# EAGLE design rev1 (EAGLE 9.6.2)
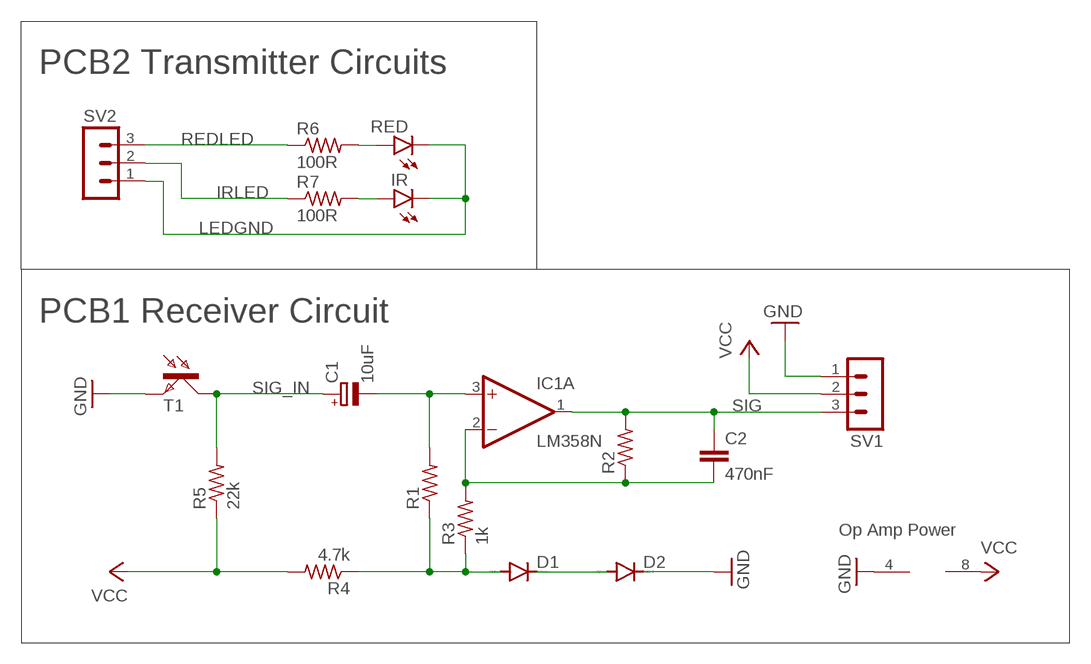
[diagram p0: schematic, sheet 1]

## Parts
C1  10uF  CPOL-EUR/2012-12R  [R/2012-12R]
C2  470nF  C2,5-3  [C2.5-3]
D1  1N4148DO35-7  [DO35-7]
D2  1N4148DO35-7  [DO35-7]
IC1  LM358N  [DIL08]
IR  LEDIRL80A  [IRL80A]
R1  R-US_0207/7  [0207/7]
R2  R-US_0207/7  [0207/7]
R3  1k  R-US_R0805  [R0805]
R4  4.7k  R-US_0207/7  [0207/7]
R5  22k  R-US_0207/7  [0207/7]
R6  100R  R-US_R0805  [R0805]
R7  100R  R-US_R0805  [R0805]
RED  LEDCHIPLED_0805  [CHIPLED_0805]
SV1  MA03-1  [MA03-1]
SV2  MA03-1  [MA03-1]
T1  LPT80A  [LPT80A]

## Nets
GND: D2.C IC1.4(P:V-) SV1.1 T1.E
IRLED: R7.1 SV2.2
LEDGND: IR.K(C) RED.C SV2.1
N$1: C1.- IC1.3(A:+IN) R1.2
N$2: R6.2 RED.A
N$3: C2.2 IC1.2(A:-IN) R2.1 R3.2
N$5: D1.C D2.A
N$7: IR.A R7.2
N$8: D1.A R1.1 R3.1 R4.1
REDLED: R6.1 SV2.3
SIG: C2.1 IC1.1(A:OUT) R2.2 SV1.3
SIG_IN: C1.+ R5.2 T1.C
VCC: IC1.8(P:V+) R4.2 R5.1 SV1.2
Unconnected: IC1.5(B:+IN) IC1.6(B:-IN) IC1.7(B:OUT)

## Notes on the sheet
- PCB2 Transmitter Circuits
- PCB1 Receiver Circuit
- Op Amp Power

## Library data of the parts
C1 = rcl:CPOL-EU: POLARIZED CAPACITOR, European symbol; SPICEPREFIX: C
C2 = capacitor-wima:C: CAPACITOR naming: grid - package width
D1 D2 = diode:1N4148: DIODE high speed (Philips)
IC1 = linear:LM358: OP AMP also LM158; LM258; LM2904 Source: http://cache.national.com/ds/LM/LM158.pdf
IR RED = led:LED: LED OSRAM: - CHIPLED LG R971, LG N971, LY N971, LG Q971, LY Q971, LO R971, LY R971 LH N974, LH R974 LS Q976, LO Q976, LY Q976 LO Q996 - Hyper CHIPLED LW Q18S LB Q993, LB Q99A, LB R99A - SideLED LS A670, LO A670, LY A670, LG A670, LP A670 LB A673, LV A673, LT A673, LW A673 LH A674 LY A675 LS A676, LA A676, LO A676, LY A676, LW A676 LS A679, LY A679, LG A679 - Hyper Micro SIDELED® LS Y876, LA Y876, LO Y876, LY Y876 LT Y87S - SmartLED LW L88C, LW L88S LB L89C, LB L89S, LG L890 LS L89K, LO L89K, LY L89K LS L896, LA L896, LO L896, LY L896 - TOPLED LS T670, LO T670, LY T670, LG T670, LP T670 LSG T670, LSP T670, LSY T670, LOP T670, LYG T670 LG T671, LOG T671, LSG T671 LB T673, LV T673, LT T673, LW T673 LH T674 LS T676, LA T676, LO T676, LY T676, LB T676, LH T676, LSB T676, LW T676 LB T67C, LV T67C, LT T67C, LS T67K, LO T67K, LY T67K, LW E67C LS E67B, LA E67B, LO E67B, LY E67B, LB E67C, LV E67C, LT E67C LW T67C LS T679, LY T679, LG T679 LS T770, LO T770, LY T770, LG T770, LP T770 LB T773, LV T773, LT T773, LW T773 LH T774 LS E675, LA E675, LY E675, LS T675 LS T776, LA T776, LO T776, LY T776, LB T776 LHGB T686 LT T68C, LB T68C - Hyper Mini TOPLED® LB M676 - Mini TOPLED Santana® LG M470 LS M47K, LO M47K, LY M47K Source: http://www.osram.convergy.de LUXEON: - LUMILED® LXK2-PW12-R00, LXK2-PW12-S00, LXK2-PW14-U00, LXK2-PW14-V00 LXK2-PM12-R00, LXK2-PM12-S00, LXK2-PM14-U00 LXK2-PE12-Q00, LXK2-PE12-R00, LXK2-PE12-S00, LXK2-PE14-T00, LXK2-PE14-U00 LXK2-PB12-K00, LXK2-PB12-L00, LXK2-PB12-M00, LXK2-PB14-N00, LXK2-PB14-P00, LXK2-PB14-Q00 LXK2-PR12-L00, LXK2-PR12-M00, LXK2-PR14-Q00, LXK2-PR14-R00 LXK2-PD12-Q00, LXK2-PD12-R00, LXK2-PD12-S00 LXK2-PH12-R00, LXK2-PH12-S00 LXK2-PL12-P00, LXK2-PL12-Q00, LXK2-PL12-R00 Source: www.luxeon.com KINGBRIGHT: KA-3528ASYC Source: www.kingbright.com
R1-R7 = rcl:R-US_: RESISTOR, American symbol; SPICEPREFIX: R
SV1 SV2 = con-lstb:MA03-1: PIN HEADER; OC_FARNELL: unknown; OC_NEWARK: unknown
T1 = opto-trans-siemens:LPT80A: PHOTO TRANSISTOR; OC_FARNELL: unknown; OC_NEWARK: unknown

## Board
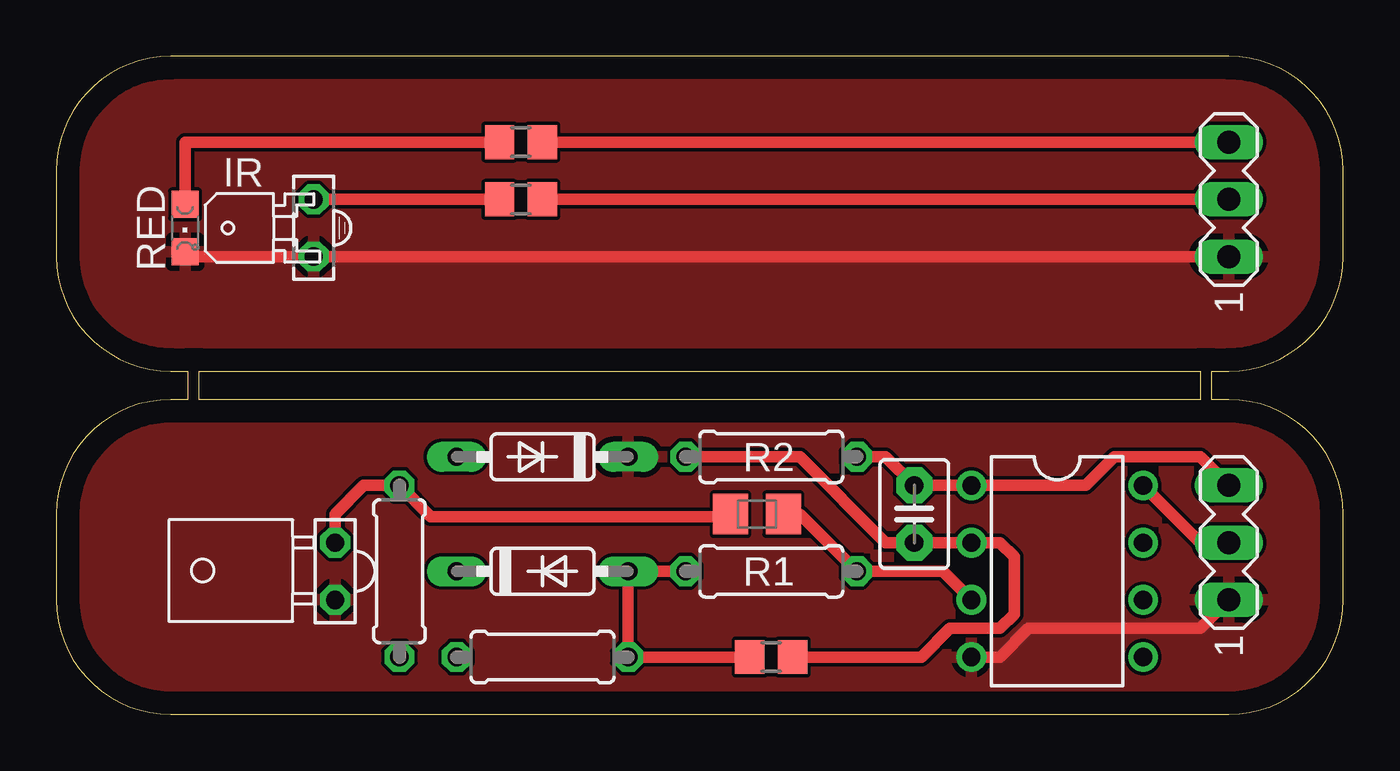
[diagram p1: board, top side]
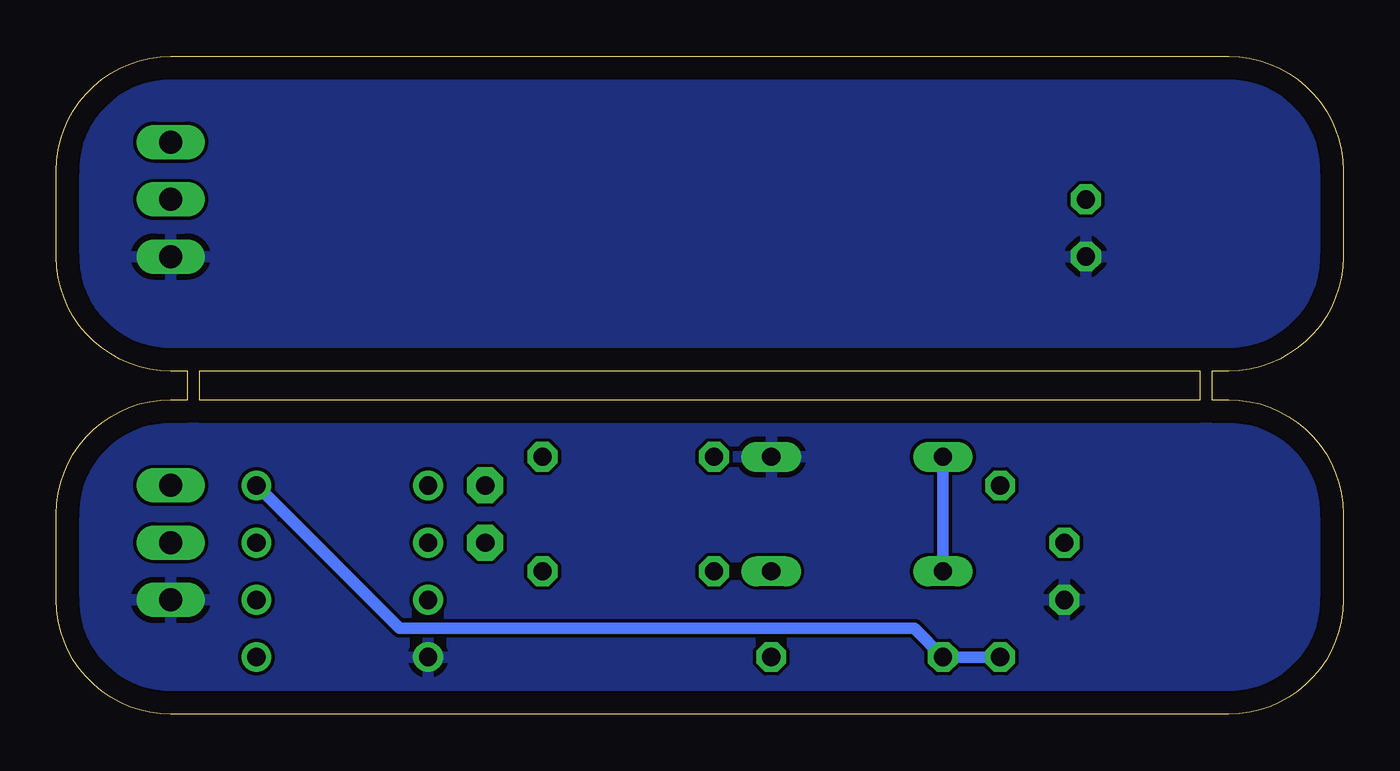
[diagram p2: board, bottom side, seen from below]

Size 57.15 x 29.21 mm. Coordinates in mm from the lower left corner, seen from the top.
Outline: 0,8.89 0,5.08 arc90 5.08,0 52.07,0 arc90 57.15,5.08 57.15,8.89 arc90 52.07,13.97 51.31,13.97 51.31,15.24 52.07,15.24 arc90 57.15,20.32 57.15,24.13 arc90 52.07,29.21 5.08,29.21 arc90 0,24.13 0,20.32 arc90 5.08,15.24 5.84,15.24 5.84,13.97 5.08,13.97 arc90 0,8.89
Outline: 6.35,13.97 6.35,15.24 50.8,15.24 50.8,13.97 6.35,13.97
Copper layers (1*16): Top 0.035mm / dielectric 1.5mm / Bottom 0.035mm
Design rules "default": minimum track width 6mil, minimum drill 0.35mm, track to track 6mil, track to pad 6mil, pad to pad 6mil, via to via 6mil, smd to smd 6mil, copper to edge 40mil, drill to drill 6mil, minimum pad ring 10mil, minimum via ring 8mil, stop-mask expansion 4mil, vias tented up to drill 0mil, thermal gap 10mil

### Footprints (pad centres in the part's own frame; a part is rotated, then mirrored left to right if it is on the bottom)
R/2012-12R = smd 1.55 x 1.8: + 1.175,0; - -1.175,0
C2.5-3 = drill 0.813 pad 1.6 octagon: 1 -1.27,0; 2 1.27,0
DO35-7 = drill 0.813 long: A 3.81,0; C -3.81,0
DIL08 = drill 0.813 pad 1.27: 1 -3.81,-3.81; 2 -1.27,-3.81; 3 1.27,-3.81; 4 3.81,-3.81; 5 3.81,3.81; 6 1.27,3.81; 7 -1.27,3.81; 8 -3.81,3.81
IRL80A = drill 0.813 octagon: A 0,-1.27; K 0,1.27
0207/7 = drill 0.813 octagon: 1 -3.81,0; 2 3.81,0
R0805 = smd 1.3 x 1.5: 1 -0.95,0; 2 0.95,0
CHIPLED_0805 = smd 1.2 x 1.2: A 0,-1.05; C 0,1.05
MA03-1 = drill 1.016 long: 1 -2.54,0; 2 0,0; 3 2.54,0
LPT80A = drill 0.813 octagon: C 0,-1.27; E 0,1.27

### Placement (x,y rotation side)
C1  31.11,8.89 180 top
C2  38.1,8.89 270 top
D1  21.59,6.35 0 top
D2  21.59,11.43 180 top
IC1  44.45,6.35 270 top
IR  11.43,21.59 180 top
R1  31.75,6.35 0 top
R2  31.75,11.43 0 top
R3  31.75,2.54 0 top
R4  21.59,2.54 180 top
R5  15.24,6.35 90 top
R6  20.64,25.4 180 top
R7  20.64,22.86 180 top
RED  5.71,21.59 180 top
SV1  52.07,7.62 90 top
SV2  52.07,22.86 90 top
T1  12.38,6.35 180 top

### Tracks (layer width: path | path; a pad name or v marks a point on that pad's centre or on a via)
GND
  Top 0.508: SV1.1 50.8,3.81 43.18,3.81 41.91,2.54 IC1.4
  pour Top: 52.07,13.97 5.08,13.97 arc90 0,8.89 0,5.08 arc90 5.08,0 52.07,0 arc90 57.15,5.08 57.15,8.89 arc90
  pour Bottom: 30.48,13.97 5.08,13.97 arc90 0,8.89 0,6.35 0,5.08 arc90 5.08,0 30.48,0 52.07,0 arc90 57.15,5.08 57.15,6.35 57.15,8.89 arc90 52.07,13.97
IRLED
  Top 0.508: SV2.2 R7.1
LEDGND
  Top 0.508: SV2.1 46.99,20.32 IR.K 5.93,20.32 RED.C
  pour Top: 0,20.32 0,24.13 arc-90 5.08,29.21 52.07,29.21 arc-90 57.15,24.13 57.15,20.32 arc-90 52.07,15.24 5.08,15.24 arc-90
  pour Bottom: 0,20.32 0,24.13 arc-90 5.08,29.21 52.07,29.21 arc-90 57.15,24.13 57.15,20.32 arc-90 52.07,15.24 5.08,15.24 arc-90
N$1
  Top 0.508: IC1.3 39.37,6.35 R1.2 33.02,8.89 C1.-
N$2
  Top 0.508: RED.A 5.71,25.4 R6.2
N$3
  Top 0.508: R2.1 33.02,11.43 36.83,7.62 C2.2 IC1.2 41.91,7.62 42.55,6.99 42.55,4.45 41.91,3.81 39.69,3.81 38.41,2.54 R3.2
N$5
  Bottom 0.508: D2.A D1.C
N$7
  Top 0.508: R7.2 IR.A
N$8
  Top 0.508: R3.1 R4.1 D1.A R1.1
REDLED
  Top 0.508: R6.1 SV2.3
SIG
  Top 0.508: R2.2 36.83,11.43 C2.1 IC1.1 45.72,10.16 46.99,11.43 50.8,11.43 SV1.3
SIG_IN
  Top 0.508: T1.C 12.38,8.89 13.65,10.16 R5.2 16.62,8.78 29.83,8.78 C1.+
VCC
  Top 0.508: SV1.2 50.8,7.62 IC1.8
  Bottom 0.508: IC1.8 41.91,3.81 19.05,3.81 R4.2 R5.1